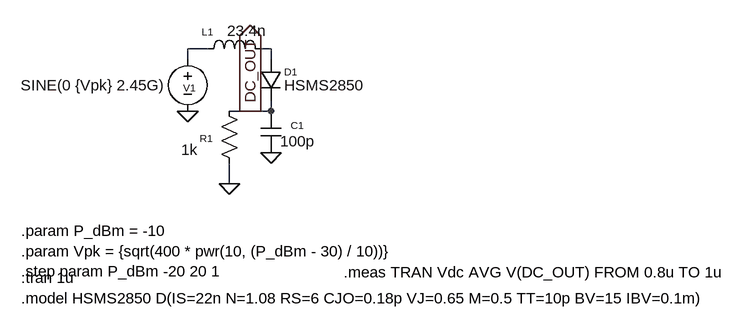
[diagram p0: schematic single-diode_(half-wave)_rectifier_sim.asc]
single-diode_(half-wave)_rectifier_sim.asc, the LTspice schematic file:
Version 4
SHEET 1 948 688
WIRE 176 288 144 288
WIRE 272 288 256 288
WIRE 144 304 144 288
WIRE 272 304 272 288
WIRE 240 384 208 384
WIRE 272 384 272 368
WIRE 272 384 240 384
WIRE 208 496 208 464
FLAG 144 384 0
FLAG 208 496 0
FLAG 272 448 0
FLAG 240 384 DC_OUT
IOPIN 240 384 Out
SYMBOL voltage 144 288 R0
WINDOW 0 -7 60 Left 1
WINDOW 3 -257 56 Left 2
SYMATTR InstName V1
SYMATTR Value SINE(0 {Vpk} 2.45G)
SYMATTR SpiceLine Rser=50
SYMBOL Cap 256 384 R0
WINDOW 0 46 22 Left 1
WINDOW 3 30 46 Left 2
SYMATTR InstName C1
SYMATTR Value 100p
SYMBOL Res 192 368 R0
WINDOW 0 -30 58 Left 1
WINDOW 3 -58 75 Left 2
SYMATTR InstName R1
SYMATTR Value 1k
SYMBOL Diode 256 304 R0
WINDOW 0 36 19 Left 1
WINDOW 3 36 40 Left 2
SYMATTR InstName D1
SYMATTR Value HSMS2850
SYMBOL ind 160 304 R270
WINDOW 0 32 14 VTop 1
WINDOW 3 59 75 VBottom 2
SYMATTR InstName L1
SYMATTR Value 23.4n
TEXT -112 672 Left 2 !.model HSMS2850 D(IS=22n N=1.08 RS=6 CJO=0.18p VJ=0.65 M=0.5 TT=10p BV=15 IBV=0.1m)
TEXT -112 640 Left 2 !.tran 1u
TEXT -112 568 Left 2 !.param P_dBm = -10\n.param Vpk = {sqrt(400 * pwr(10, (P_dBm - 30) / 10))}\n.step param P_dBm -20 20 1
TEXT 384 632 Left 2 !.meas TRAN Vdc AVG V(DC_OUT) FROM 0.8u TO 1u

The netlist it stands for:
* single-diode_(half-wave)_rectifier_sim.asc
V1 N001 0 SINE(0 {Vpk} 2.45G) Rser=50
C1 DC_OUT 0 100p
R1 DC_OUT 0 1k
D1 N002 DC_OUT HSMS2850
L1 N001 N002 23.4n
.model D D
.lib standard.dio
.model HSMS2850 D(IS=22n N=1.08 RS=6 CJO=0.18p VJ=0.65 M=0.5 TT=10p BV=15 IBV=0.1m)
.tran 1u
.param P_dBm = -10
.param Vpk = {sqrt(400 * pwr(10, (P_dBm - 30) / 10))}
.step param P_dBm -20 20 1
.meas TRAN Vdc AVG V(DC_OUT) FROM 0.8u TO 1u
.backanno
.end